# EasyEDA Pro project ESD_System.eprj, board PCB4
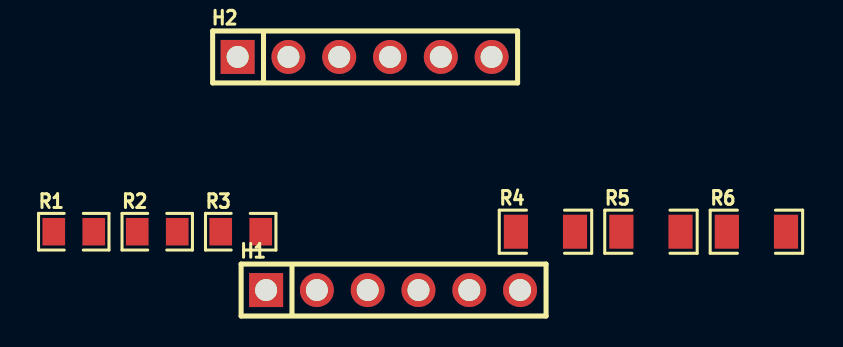
[diagram p6: board, top side]
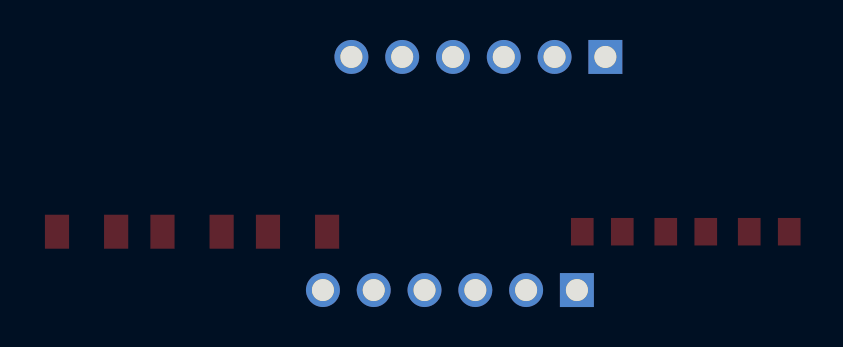
[diagram p7: board, bottom side, seen from below]

No outline. copper layers: Top Layer, Bottom Layer. Coordinates in mm from the lowest, leftmost part position.
Stack: Top Layer 0.035mm / Dielectric1 1.51mm FR4 er 4.5 / Bottom Layer 0.035mm

## Design rules (mm)
template: JLCPCB Capability(Two Layers Board)
spacing copperThickness1oz (default): track to track 0.102, other pairs 0.152 to 0.3
spacing copperThickness2oz: track to track 0.203, other pairs 0.152 to 0.3
track width copperThickness1oz (default): min 0.127, default 0.254, max 2.54
track width copperThickness2oz: min 0.203, default 0.254, max 2.54
differential pair differentialPair (default): width min 0.127, default 0.254, max 2.54; gap min 0.152, default 0.152
via viaSize (default): diameter min 0.5, default 0.61, max 10; hole min 0.3, default 0.305, max 6.3

## Placement (name value [footprint] x y rotation side)
H1  HX PH254-01-06-Z-L11.5 through hole header  [HDR-TH_6P-P2.54-V-M]  15.97 0 0 top
H2  HX PH254-01-06-Z-L11.5 through hole header  [HDR-TH_6P-P2.54-V-M]  14.55 11.67 0 top
R1  750kΩ  [R0805]  0 2.92 0 top
R2  1MΩ  [R0805]  4.17 2.92 0 top
R3  2MΩ  [R0805]  8.35 2.92 0 top
R4  5MΩ  [R1206]  23.59 2.92 0 top
R5  7.5MΩ  [R1206]  28.86 2.92 0 top
R6  10MΩ  [R1206]  34.14 2.92 0 top

## Footprints (pads in the part's own frame, mm; a bottom-side part is the same pattern mirrored in y, then rotated)
HDR-TH_6P-P2.54-V-M
  rect 1.7x1.7 hole 1.1: 1(-6.35,0)
  round 1.7 hole 1.1: 2(-3.81,0) 3(-1.27,0) 4(1.27,0) 5(3.81,0) 6(6.35,0)
R0805
  rect 1.133x1.377 smd: 1(-1,0) 2(1,0)
R1206
  rect 1.208x1.701 smd: 1(-1.479,0) 2(1.479,0)

## Nets
$1N1716: H1.1 H2.5 R5.2 R6.1
$1N1897: H1.5 H2.1 R1.2 R2.1
$1N1901: H1.4 H2.2 R2.2 R3.1
$1N1906: H1.3 H2.3 R3.2 R4.1
$1N2059: H1.6 R1.1
$1N2618: H1.2 H2.4 R4.2 R5.1
$1N2873: H2.6 R6.2
